# EAGLE design cardReader (EAGLE 8.4.0)
DELETE: MF
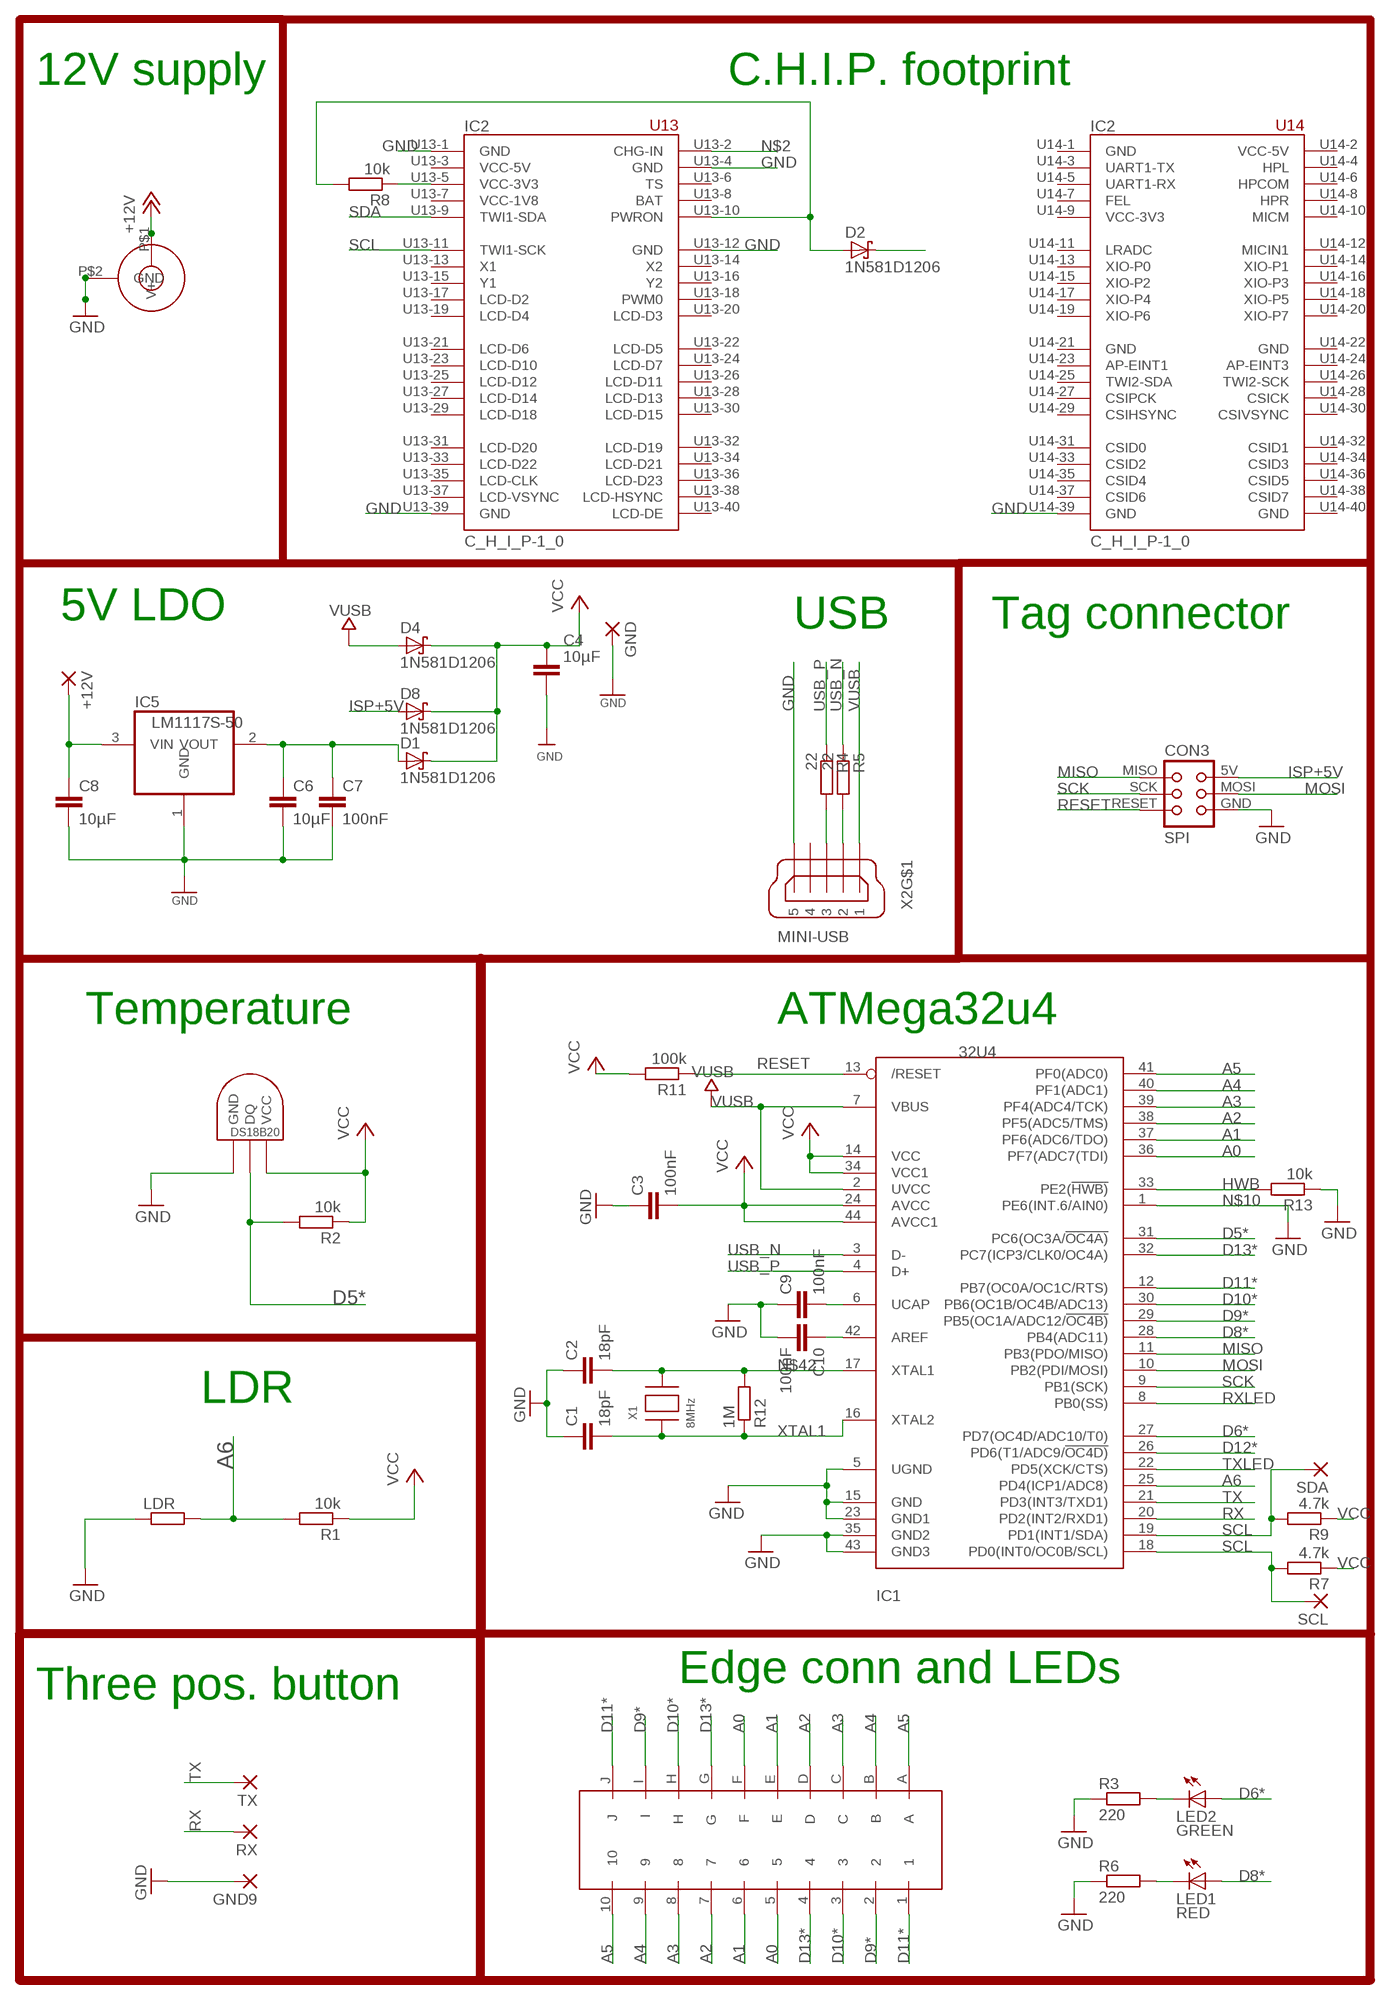
[diagram p0: schematic, sheet 1]

## Parts
+12V  SMD5  [SMD2,54-5,08]
C1  18pF  C-EUC0805K  [C0805K]
C2  18pF  C-EUC0805K  [C0805K]
C3  100nF  C-EUC0805K  [C0805K]
C4  10µF  CAPACITOR_NPOL-1206  [C1206]
C6  10µF  C-EUC0805K  [C0805K]
C7  100nF  C-EUC0805K  [C0805K]
C8  10µF  C-EUC0805K  [C0805K]
C9  100nF  C-EUC0805K  [C0805K]
C10  100nF  C-EUC0805K  [C0805K]
CON2  JACK_DC_BARREL  [DC_BARREL]
CON3  SPI  TINYISPT  [TC2030-MCP-NL]
D1  1N581D1206  [LED-1206]
D2  1N581D1206  [LED-1206]
D4  1N581D1206  [LED-1206]
D8  1N581D1206  [LED-1206]
GND  SMD5  [SMD2,54-5,08]
GND9  SMD5  [SMD2,54-5,08]
IC1  32U4  ATMEGA32U4-AU  [TQFP44]
IC2  C_H_I_P-1_0  [C_H_I_P-1_0]
IC5  LM1117S-50  REG1117  [SOT223]
LDR  R-EU_0207/2V  [0207/2V]
LED1  RED  LED5MM  [LED5MM]
LED2  GREEN  LED5MM  [LED5MM]
R1  10k  R-EU_R0805  [R0805]
R2  10k  R-EU_R0805  [R0805]
R3  220  R-EU_0204/7  [0204/7]
R4  22  R-EU_R0805  [R0805]
R5  22  R-EU_R0805  [R0805]
R6  220  R-EU_0204/7  [0204/7]
R7  4.7k  R-EU_R0805  [R0805]
R8  10k  R-EU_R0805  [R0805]
R9  4.7k  R-EU_R0805  [R0805]
R11  100k  R-EU_R0805  [R0805]
R12  1M  R-EU_R0805  [R0805]
R13  10k  R-EU_R0805  [R0805]
RX  SMD5  [SMD2,54-5,08]
SCL  SMD5  [SMD2,54-5,08]
SDA  SMD5  [SMD2,54-5,08]
TX  SMD5  [SMD2,54-5,08]
U$1  DS1820TO92  [DS1820]
U$3  CONN2X10PRINT  [CONN2X10PRINT]
X1  8MHz  XTALNX6035  [NX6035]
X2  MINI-USB  MINI-USB-SCHIELD-32005-201  [32005-201]

## Nets
+12V: +12V.1(P) C8.1 CON2.P$1(V+) IC5.3(VIN)
A0: IC1.36(PF7(ADC7(TDI)) U$3.5 U$3.F
A1: IC1.37(PF6(ADC6/TDO)) U$3.6 U$3.E
A2: IC1.38(PF5(ADC5/TMS)) U$3.7 U$3.D
A3: IC1.39(PF4(ADC4/TCK)) U$3.8 U$3.C
A4: IC1.40(PF1(ADC1)) U$3.9 U$3.B
A5: IC1.41(PF0(ADC0)) U$3.10 U$3.A
A6: IC1.25(PD4(ICP1/ADC8)) LDR.2 R1.2
AREF: C10.1 IC1.42(AREF)
D5*: IC1.31(PC6(OC3A/!OC4A)) R2.2 U$1.DQ
D6*: IC1.27(PD7(OC4D/ADC10/T0)) LED2.A
D8*: IC1.28(PB4(ADC11)) LED1.A
D9*: IC1.29(PB5(OC1A/ADC12/!OC4B)) U$3.2 U$3.I
D10*: IC1.30(PB6(OC1B/OC4B/ADC13)) U$3.3 U$3.H
D11*: IC1.12(PB7(OC0A/OC1C/RTS)) U$3.1 U$3.J
D12*: IC1.26(PD6(T1/ADC9/!OC4D))
D13*: IC1.32(PC7(ICP3/CLK0/OC4A)) U$3.4 U$3.G
GND [power]: C1.1 C2.1 C3.1 C4.2 C6.2 C7.2 C8.2 C9.1 C10.2 CON2.P$2(GND) CON3.GND GND9.1(P) GND.1(P) IC1.5(UGND) IC1.15(GND) IC1.23(GND1) IC1.35(GND2) IC1.43(GND3) IC2.U13-1(GND) IC2.U13-4(GND) IC2.U13-12(GND) IC2.U13-39(GND) IC2.U14-39(GND) IC5.1(GND) LDR.1 R3.1 R6.1 R13.1 U$1.GND X2.5
HWB: IC1.33(PE2(!HWB)) R13.2
ISP+5V: CON3.5V(VCC) D8.A
MISO: CON3.MISO IC1.11(PB3(PDO/MISO))
MOSI: CON3.MOSI IC1.10(PB2(PDI/MOSI))
N$1: C9.2 IC1.6(UCAP)
N$2: IC2.U13-2(CHG-IN)
N$3: LED2.K(C) R3.2
N$4: LED1.K(C) R6.2
N$9: C6.1 C7.1 D1.A IC5.2(VOUT)
N$10: D2.C IC1.1(PE6(INT.6/AIN0)) ; supply symbol labelled GND
N$42: C2.2 IC1.17(XTAL1) R12.2 X1.P$2
PWRON: D2.A IC2.U13-10(PWRON) R8.2
RESET: CON3.RESET IC1.13(/RESET) R11.1
RX: IC1.20(PD2(INT2/RXD1)) RX.1(P)
RXLED: IC1.8(PB0(SS))
SCK: CON3.SCK IC1.9(PB1(SCK))
SCL: IC1.18(PD0(INT0/OC0B/SCL)) IC2.U13-11(TWI1-SCK) R7.2 SCL.1(P)
SDA: IC1.19(PD1(INT1/SDA)) IC2.U13-9(TWI1-SDA) R9.2 SDA.1(P)
TX: IC1.21(PD3(INT3/TXD1)) TX.1(P)
TXLED: IC1.22(PD5(XCK/CTS))
USB_N: IC1.3(D-) R5.1
USB_P: IC1.4(D+) R4.1
USBC_N: R5.2 X2.2
USBC_P: R4.2 X2.3
VCC: C3.2 C4.1 D1.C D4.C D8.C IC1.14(VCC) IC1.24(AVCC) IC1.34(VCC1) IC1.44(AVCC1) R1.1 R2.1 R7.1 R9.1 R11.2 U$1.VDD(VCC)
VCC-3V3@1: IC2.U13-5(VCC-3V3) R8.1
VUSB: D4.A IC1.2(UVCC) IC1.7(VBUS) X2.1
XTAL1: C1.2 IC1.16(XTAL2) R12.1 X1.P$1
Unconnected: IC2.U13-3(VCC-5V) IC2.U13-6(TS) IC2.U13-7(VCC-1V8) IC2.U13-13(X1) IC2.U13-14(X2) IC2.U13-15(Y1) IC2.U13-16(Y2) IC2.U13-17(LCD-D2) IC2.U13-18(PWM0) IC2.U13-19(LCD-D4) IC2.U13-20(LCD-D3) IC2.U13-21(LCD-D6) IC2.U13-22(LCD-D5) IC2.U13-23(LCD-D10) IC2.U13-24(LCD-D7) IC2.U13-25(LCD-D12) IC2.U13-26(LCD-D11) IC2.U13-27(LCD-D14) IC2.U13-28(LCD-D13) IC2.U13-29(LCD-D18) IC2.U13-30(LCD-D15) IC2.U13-31(LCD-D20) IC2.U13-32(LCD-D19) IC2.U13-33(LCD-D22) IC2.U13-34(LCD-D21) IC2.U13-35(LCD-CLK) IC2.U13-36(LCD-D23) IC2.U13-37(LCD-VSYNC) IC2.U13-38(LCD-HSYNC) IC2.U13-40(LCD-DE) IC2.U14-2(VCC-5V) IC2.U14-3(UART1-TX) IC2.U14-4(HPL) IC2.U14-5(UART1-RX) IC2.U14-6(HPCOM) IC2.U14-7(FEL) IC2.U14-8(HPR) IC2.U14-9(VCC-3V3) IC2.U14-10(MICM) IC2.U14-11(LRADC) IC2.U14-12(MICIN1) IC2.U14-13(XIO-P0) IC2.U14-14(XIO-P1) IC2.U14-15(XIO-P2) IC2.U14-16(XIO-P3) IC2.U14-17(XIO-P4) IC2.U14-18(XIO-P5) IC2.U14-19(XIO-P6) IC2.U14-20(XIO-P7) IC2.U14-23(AP-EINT1) IC2.U14-24(AP-EINT3) IC2.U14-25(TWI2-SDA) IC2.U14-26(TWI2-SCK) IC2.U14-27(CSIPCK) IC2.U14-28(CSICK) IC2.U14-29(CSIHSYNC) IC2.U14-30(CSIVSYNC) IC2.U14-31(CSID0) IC2.U14-32(CSID1) IC2.U14-33(CSID2) IC2.U14-34(CSID3) IC2.U14-35(CSID4) IC2.U14-36(CSID5) IC2.U14-37(CSID6) IC2.U14-38(CSID7) X2.4 X2.M1(S:S1) X2.M2(S:S2) X2.M3(S:S3) X2.M4(S:S4)

## Notes on the sheet
- 12V supply | C.H.I.P. footprint
- 5V LDO | USB | Tag connector
- Temperature | ATMega32u4
- LDR
- Edge conn and LEDs
- Three pos. button

## Power pins joined to a net without a drawn wire
BAT: IC2.U13-8(BAT)
GND: IC2.U14-1(GND) IC2.U14-21(GND) IC2.U14-22(GND) IC2.U14-40(GND)

## Library data of the parts
+12V GND GND9 RX SCL SDA TX = wirepad:SMD5: SMD PAD
C1 C2 = rcl:C-EU: CAPACITOR, European symbol; ELECROW: C1797; LCSC: C1797; MPN: 77-VJ1206A180JXXPBC
C3 C7 C9 C10 = rcl:C-EU: CAPACITOR, European symbol; ELECROW: C49678; LCSC: C49678; MPN: 80-C1206C104K5R
C4 = dp_devices:CAPACITOR_NPOL: Non-Polarized capacitor in various packages
C6 C8 = rcl:C-EU: CAPACITOR, European symbol; ELECROW: C15850; LCSC: C15850; MPN: 77-VJ1206V106ZXQTBC
CON2 = lpatiny:JACK_DC_BARREL
CON3 = lpatiny:TINYISP: CONNECTOR
D1 D2 D4 D8 = lpatiny:1N581*: 1.0A SCHOTTKY BARRIER RECTIFIER Source: http://www.diodes.com/datasheets/ds23001.pdf
IC1 = adafruit:ATMEGA32U4: http://www.ladyada.net/library/eagle; LCSC: C44854; MPN: 556-ATMEGA32U4RC-AU
IC2 = SENG:C_H_I_P-1_0: C.H.I.P. 1.0 Linux computer module with on chip power management unit
IC5 = burr-brown:REG1117: 800mA and 1A Low Dropout (LDO) Positive Regulator 1.8V, 2.5V, 2.85V, 3.3V, 5V, and Adj; LCSC: C126027; MPN: REG1117; OC_FARNELL: 1097566; OC_NEWARK: 14P6981
LDR R3 R6 = rcl:R-EU_: RESISTOR, European symbol
LED1 LED2 = SparkFun:LED: LEDs Standard schematic elements and footprints for 5mm, 3mm, 1206, and 0603 sized LEDs. 5mm - Spark Fun Electronics SKU : COM-00529 (and others)
R1 R2 R7-R9 R11 = rcl:R-EU_: RESISTOR, European symbol; ELECROW: C17407; LCSC: C17407; MPN: RC1206FR-07100KL
R4 R5 = rcl:R-EU_: RESISTOR, European symbol; ELECROW: C17561; LCSC: C17561
R12 = rcl:R-EU_: RESISTOR, European symbol; ELECROW: C17514; LCSC: C17514
R13 = rcl:R-EU_: RESISTOR, European symbol; ELECROW: C17414; LCSC: C17414
U$1 = Ava:DS1820: DS18B20 Programmable Resolution 1-Wire Digital Thermometer Description The DS18B20 digital thermometer provides 9-bit to 12-bit Celsius temperature measurements and has an alarm function with nonvolatile user-programmable upper and lower trigger points. The DS18B20 communicates over a 1-Wire® bus that by definition requires only one data line (and ground) for communication with a central microprocessor. It has an operating temperature range of -55°C to +125°C and is accurate to ±0.5°C over the range of -10°C to +85°C. In addition, the DS18B20 can derive power directly from the data line ("parasite power"), eliminating the need for an external power supply. Each DS18B20 has a unique 64-bit serial code, which allows multiple DS18B20s to function on the same 1-Wire bus. Thus, it is simple to use one microprocessor to control many DS18B20s distributed over a large area. Applications that can benefit from this feature include HVAC environmental controls, temperature monitoring systems inside buildings, equipment, or machinery, and process monitoring and control systems.
U$3 = edgeConn2x10:CONN2X10PRINT: Footprint for 10/20 edge connector.
X1 = lpatiny:XTAL: Low cost SMT crystals, no capacitors included http://www.ladyada.net/library/eagle; LCSC: C122522; MPN: 729-F60800010
X2 = con-cypressindustries:MINI-USB-SCHIELD-: MINI USB-B Conector Source: www.cypressindustries.com; LCSC: C46391; MPN: 649-10033526-N3212LF

## Net classes
0 default: width 0.254 mm, clearance 0.25 mm
1 power: width 0.254 mm, drill 0.305 mm, clearance 0.25 mm
2 VIN: width 0.254 mm, clearance 0.25 mm
3 fine: width 0.254 mm, clearance 0.25 mm
4 aref: width 0.254 mm, clearance 0.25 mm

## Board
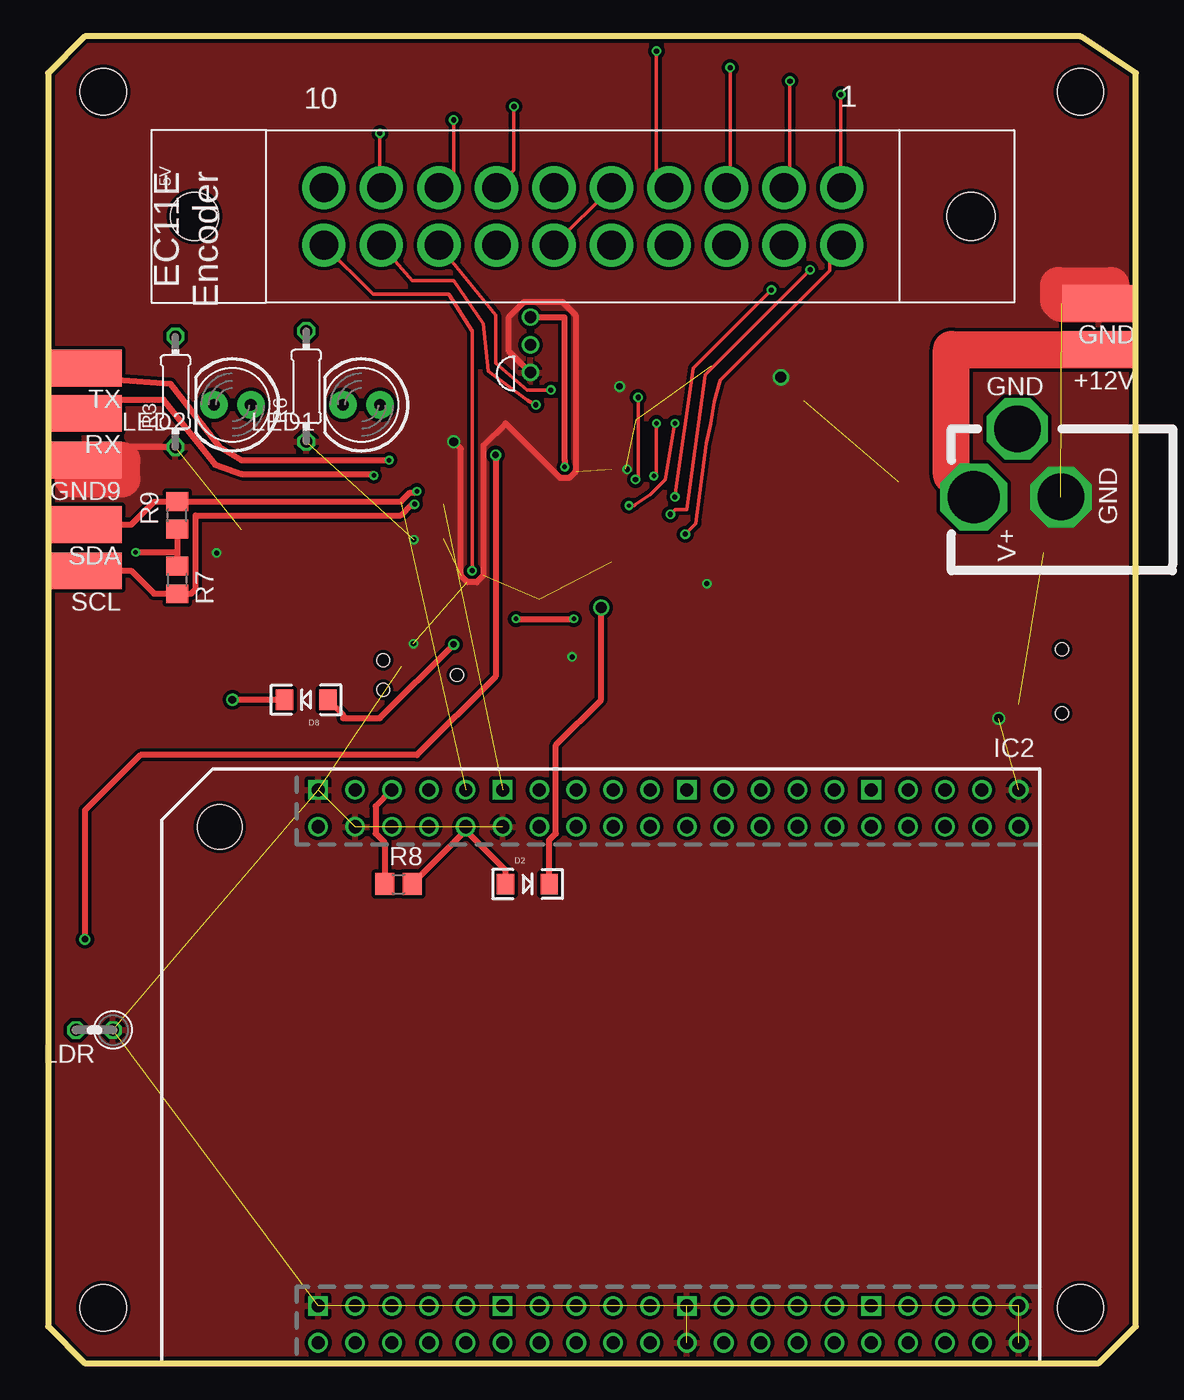
[diagram p1: board, top side]
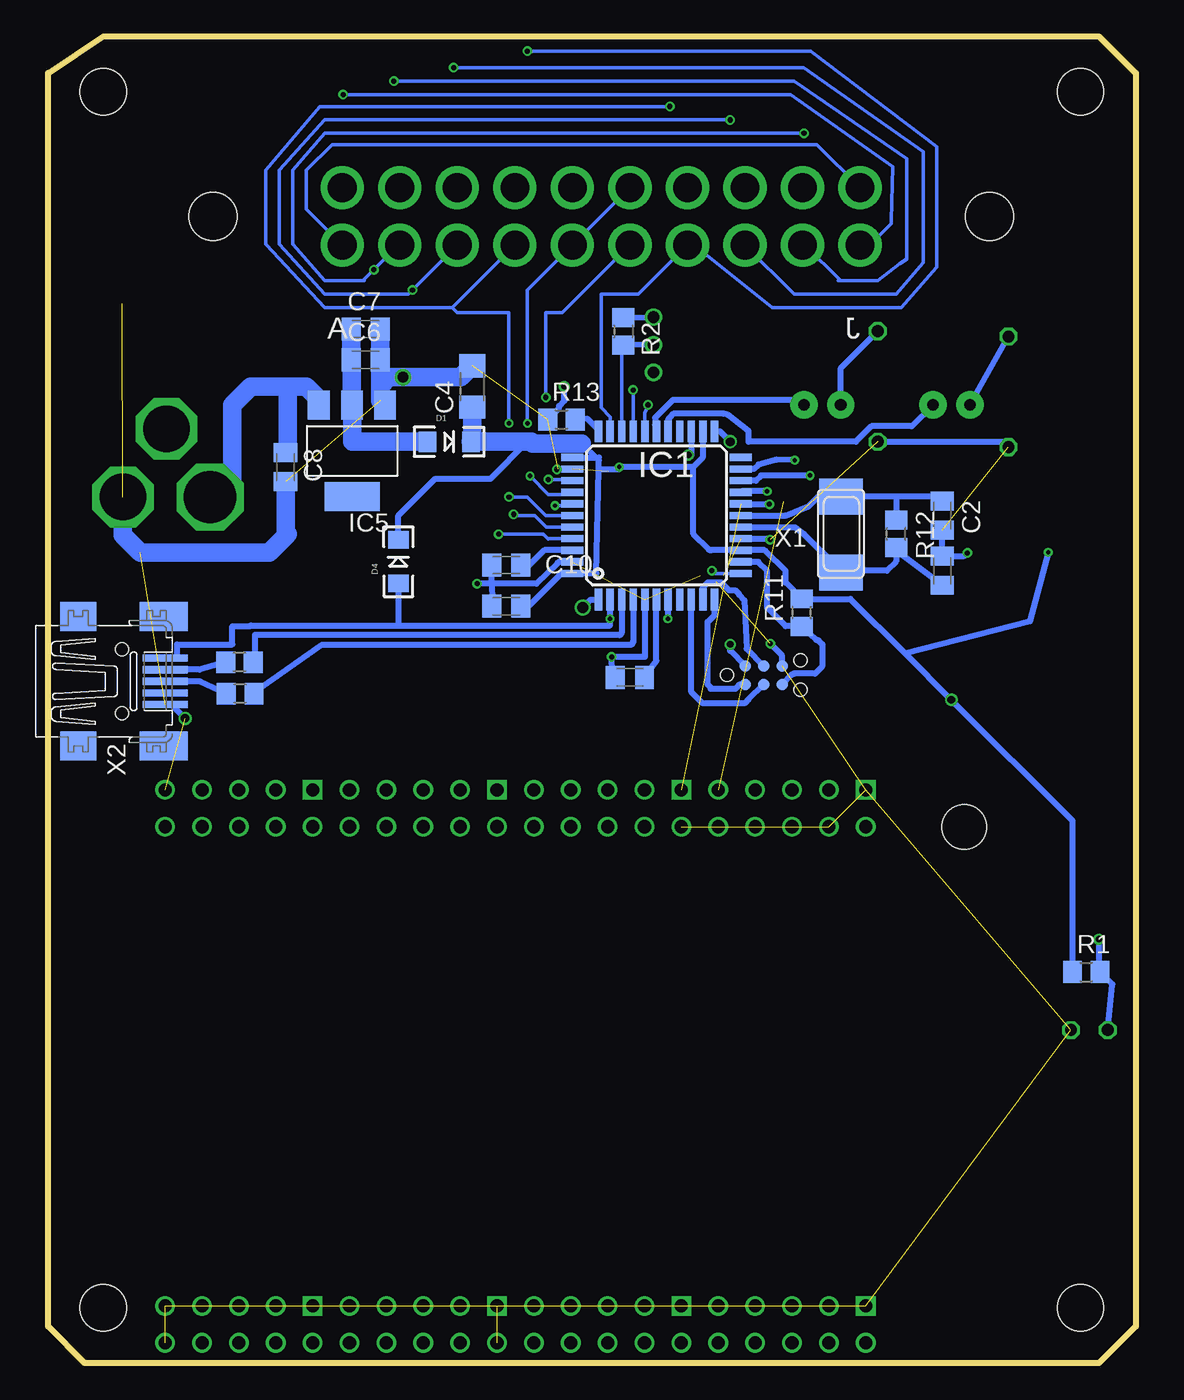
[diagram p2: board, bottom side, seen from below]

Size 74.93 x 91.44 mm. Coordinates in mm from the lower left corner, seen from the top.
Outline: 0,88.9 0,2.54 2.54,0 72.39,0 74.93,2.54 74.93,88.9 71.12,91.44 2.54,91.44 0,88.9
Copper layers (1*2*15*16): Top 0.035mm / dielectric 0.2mm / layer 2 0.0175mm / dielectric 1.1mm / layer 15 0.0175mm / dielectric 0.2mm / Bottom 0.035mm
Design rules "SeeedStudio_DRU_no_angle_20130527": minimum track width 6mil, minimum drill 12mil, track to track 6mil, track to pad 6mil, pad to pad 6mil, via to via 6mil, smd to smd 0mil, copper to edge 10mil, drill to drill 10mil, minimum pad ring 6mil, minimum via ring 6mil, stop-mask expansion 2mil, vias tented up to drill 25mil, thermal gap 10mil
Holes 3.2 mm at 3.81,87.63 3.81,3.81 71.12,87.63 71.12,3.81

### Footprints (pad centres in the part's own frame; a part is rotated, then mirrored left to right if it is on the bottom)
SMD2,54-5,08 = smd 2.54 x 5.08: 1 0,0
C0805K = smd 1.3 x 1.6: 1 -1,0; 2 1,0
C1206 = smd 1.6 x 1.803: 1 -1.422,0; 2 1.422,0
DC_BARREL = drill 3.6 pad 4.5 octagon: P$1 0,13.7 | drill 3.2 pad 4.064 octagon: P$2 0,7.7; P$3 4.7,10.7
TC2030-MCP-NL = smd 0.787 x 0.787: 5V 1.27,0.635; GND 3.81,0.635; MISO 1.27,-0.635; MOSI 2.54,0.635; RESET 3.81,-0.635; SCK 2.54,-0.635 | hole 0.889: 0,0; 5.08,-1.016; 5.08,1.016
LED-1206 = smd 1.2 x 1.4: A -1.5,0; C 1.5,0
TQFP44 = smd 1.5 x 0.5: 1 -5.8,4; 2 -5.8,3.2; 3 -5.8,2.4; 4 -5.8,1.6; 5 -5.8,0.8; 6 -5.8,0; 7 -5.8,-0.8; 8 -5.8,-1.6; 9 -5.8,-2.4; 10 -5.8,-3.2; 11 -5.8,-4; 23 5.8,-4; 24 5.8,-3.2; 25 5.8,-2.4; 26 5.8,-1.6; 27 5.8,-0.8; 28 5.8,0; 29 5.8,0.8; 30 5.8,1.6; 31 5.8,2.4; 32 5.8,3.2; 33 5.8,4 | smd 0.5 x 1.5: 12 -4,-5.8; 13 -3.2,-5.8; 14 -2.4,-5.8; 15 -1.6,-5.8; 16 -0.8,-5.8; 17 0,-5.8; 18 0.8,-5.8; 19 1.6,-5.8; 20 2.4,-5.8; 21 3.2,-5.8; 22 4,-5.8; 34 4,5.8; 35 3.2,5.8; 36 2.4,5.8; 37 1.6,5.8; 38 0.8,5.8; 39 0,5.8; 40 -0.8,5.8; 41 -1.6,5.8; 42 -2.4,5.8; 43 -3.2,5.8; 44 -4,5.8
C_H_I_P-1_0 = drill 0.9 square: U13-1 0,0; U13-11 -12.7,0; U13-21 -25.4,0; U13-31 -38.1,0; U14-1 0,35.56; U14-11 -12.7,35.56; U14-21 -25.4,35.56; U14-31 -38.1,35.56 | drill 0.9: U13-2 0,2.54; U13-3 -2.54,0; U13-4 -2.54,2.54; U13-5 -5.08,0; U13-6 -5.08,2.54; U13-7 -7.62,0; U13-8 -7.62,2.54; U13-9 -10.16,0; U13-10 -10.16,2.54; U13-12 -12.7,2.54; U13-13 -15.24,0; U13-14 -15.24,2.54; U13-15 -17.78,0; U13-16 -17.78,2.54; U13-17 -20.32,0; U13-18 -20.32,2.54; U13-19 -22.86,0; U13-20 -22.86,2.54; U13-22 -25.4,2.54; U13-23 -27.94,0; U13-24 -27.94,2.54; U13-25 -30.48,0; U13-26 -30.48,2.54; U13-27 -33.02,0; U13-28 -33.02,2.54; U13-29 -35.56,0; U13-30 -35.56,2.54; U13-32 -38.1,2.54; U13-33 -40.64,0; U13-34 -40.64,2.54; U13-35 -43.18,0; U13-36 -43.18,2.54; U13-37 -45.72,0; U13-38 -45.72,2.54; U13-39 -48.26,0; U13-40 -48.26,2.54; U14-2 0,38.1; U14-3 -2.54,35.56; U14-4 -2.54,38.1; U14-5 -5.08,35.56; U14-6 -5.08,38.1; U14-7 -7.62,35.56; U14-8 -7.62,38.1; U14-9 -10.16,35.56; U14-10 -10.16,38.1; U14-12 -12.7,38.1; U14-13 -15.24,35.56; U14-14 -15.24,38.1; U14-15 -17.78,35.56; U14-16 -17.78,38.1; U14-17 -20.32,35.56; U14-18 -20.32,38.1; U14-19 -22.86,35.56; U14-20 -22.86,38.1; U14-22 -25.4,38.1; U14-23 -27.94,35.56; U14-24 -27.94,38.1; U14-25 -30.48,35.56; U14-26 -30.48,38.1; U14-27 -33.02,35.56; U14-28 -33.02,38.1; U14-29 -35.56,35.56; U14-30 -35.56,38.1; U14-32 -38.1,38.1; U14-33 -40.64,35.56; U14-34 -40.64,38.1; U14-35 -43.18,35.56; U14-36 -43.18,38.1; U14-37 -45.72,35.56; U14-38 -45.72,38.1; U14-39 -48.26,35.56; U14-40 -48.26,38.1 | hole 3.08: 6.78,2.56
SOT223 = smd 1.499 x 2.007: 1 -2.261,-3.15; 2 0.025,-3.15; 3 2.311,-3.15 | smd 3.81 x 2.007: 4 0,3.15
0207/2V = drill 0.813 octagon: 1 -1.27,0; 2 1.27,0
LED5MM = drill 0.813 pad 1.88: A -1.27,0; K 1.27,0
R0805 = smd 1.3 x 1.5: 1 -0.95,0; 2 0.95,0
0204/7 = drill 0.813 octagon: 1 -3.81,0; 2 3.81,0
DS1820 = drill 0.8: DQ 2.54,-1.27; GND 0.635,-1.27; VDD 4.445,-1.27
CONN2X10PRINT = drill 1.981: 1 17.831,1.981; 2 13.868,1.981; 3 9.906,1.981; 4 5.944,1.981; 5 1.981,1.981; 6 -1.981,1.981; 7 -5.944,1.981; 8 -9.906,1.981; 9 -13.868,1.981; 10 -17.831,1.981; A 17.831,-1.981; B 13.868,-1.981; C 9.906,-1.981; D 5.944,-1.981; E 1.981,-1.981; F -1.981,-1.981; G -5.944,-1.981; H -9.906,-1.981; I -13.868,-1.981; J -17.831,-1.981 | hole 3.302: -26.746,0; 26.746,0
NX6035 = smd 2.5 x 3: P$1 2.665,0; P$2 -2.565,0
32005-201 = smd 3.1 x 0.5: 1 3,1.6; 2 3,0.8; 3 3,0; 4 3,-0.8; 5 3,-1.6 | smd 2.5 x 2: M1 -3,-4.45; M2 -3,4.45 | smd 3.3 x 2: M3 2.9,4.45; M4 2.9,-4.45 | hole 0.9: 0,2.2; 0,-2.2

### Placement (x,y rotation side)
+12V  72.39,69.85 90 top
C1  13.34,54.61 270 bottom
C2  13.34,58.42 90 bottom
C3  43.37,52.17 0 bottom
C4  45.72,67.31 90 bottom
C6  53.05,69.14 0 bottom
C7  53.05,71.26 0 bottom
C8  58.57,61.76 270 bottom
C9  34.85,47.26 0 bottom
C10  43.37,55 180 bottom
CON2  77.47,59.69 90 top
CON3  28.17,47.42 0 bottom
D1  47.31,63.5 0 bottom
D2  33.02,33.02 0 top
D4  50.8,55.24 90 bottom
D8  17.78,45.72 180 top
GND  72.39,73.02 90 top
GND9  2.54,62.23 90 top
IC1  33.02,58.42 90 bottom
IC2  18.61,39.51 180 top
IC5  53.98,62.87 180 bottom
LDR  3.2,22.96 180 top
LED1  21.59,66.04 180 top
LED2  12.7,66.04 180 top
R1  3.42,26.96 0 bottom
R2  35.31,71.11 270 bottom
R3  8.78,66.94 90 top
R4  61.7,46.14 180 bottom
R5  61.75,48.31 180 bottom
R6  17.78,67.31 90 top
R7  8.89,53.98 270 top
R8  24.13,33.02 0 top
R9  8.89,58.42 90 top
R11  23.01,51.73 90 bottom
R12  16.51,57.15 90 bottom
R13  39.57,65.02 0 bottom
RX  2.54,65.46 90 top
SCL  2.54,54.61 90 top
SDA  2.54,57.79 90 top
TX  2.54,68.58 90 top
U$1  31.95,67.64 90 top
U$3  36.83,79.03 0 top
X1  20.32,57.15 270 bottom
X2  69.85,46.99 0 bottom

### Tracks (layer width: path | path; a pad name or v marks a point on that pad's centre or on a via)
+12V
  Top 1.27: 71.12,69.85 +12V.1
  Top 2.54: CON2.P$1 62.23,61.23 62.23,69.85 71.12,69.85
  Bottom 1.27: IC5.3 56.29,66.34 arc-45 56.36,66.52 57.15,67.31 58.42,67.31 | 58.42,67.31 60.96,67.31 62.23,66.04 62.23,60.96 62.5,60.96 CON2.P$1 | C8.1 58.42,62.91 58.42,67.31
A0  (via drill 0.35)
  Top 0.254: U$3.F U$3.5 | v40.64,66.56 40.64,60.96 40.58,60.9 v40.46,60.9
  Bottom 0.254: U$3.F 39.51,72.39 40.64,72.39 v40.64,66.56 | v40.46,60.9 38.9,60.9 IC1.36
A1  (via drill 0.3)
  Top 0.254: v41.91,64.77 41.91,61.32 v41.73,61.14
  Bottom 0.254: U$3.6 U$3.E 41.91,73.95 v41.91,64.77 | 39.78,59.87 39.39,59.93 | 39.39,59.93 IC1.37 | v41.73,61.14 40.46,59.87 39.45,59.87 39.39,59.93
A2  (via drill 0.3, 0.35)
  Top 0.254: v32.09,86.6 32.09,82.22 U$3.7 | v43.18,64.77 42.53,60.91 41.49,59.87 40.46,59.18 40.38,59.1 v40.01,59.1
  Bottom 0.254: 47.09,72.73 55.88,72.73 59.93,77.13 59.93,82.21 56.22,86.6 v32.09,86.6 | U$3.D 47.09,72.73 | 47.09,72.73 46.75,72.39 43.18,72.39 v43.18,64.77 | v40.01,59.1 38.94,59.1 IC1.38
A3  (via drill 0.35)
  Top 0.254: v27.94,85.67 27.94,82.03 U$3.8 | v49.83,73.96 44.45,68.58 v43.18,59.69
  Bottom 0.254: v27.94,85.67 55.88,85.67 59,82.21 59,77.13 55.88,73.66 50.13,73.66 v49.83,73.96 U$3.C | v43.18,59.69 41.91,59.69 40.64,58.42 IC1.39
A4  (via drill 0.35)
  Top 0.254: v22.86,84.75 22.86,81.11 U$3.9 | v42.86,58.5 43.2,58.84 43.99,58.84 45.26,68.12 v52.49,75.35
  Bottom 0.254: 53.16,74.59 53.25,74.59 | 53.25,74.59 55.88,74.59 58.08,77.13 58.08,82.21 55.88,84.75 v22.86,84.75 | 53.25,74.59 v52.49,75.35 50.79,77.05 U$3.B | v42.86,58.5 42.79,58.42 41.41,58.42 40.62,57.62 IC1.40
  Bottom 0.406: 38.82,57.66 IC1.40
A5  (via drill 0.35)
  Top 0.254: U$3.A 53.84,76.22 53.84,75.3 46.29,67.75 45.9,66.27 45.65,64.75 45.34,63.36 44.62,57.88 44.62,57.85 v43.89,57.12
  Bottom 0.254: U$3.10 21.97,83.98 55.37,83.98 57.15,82.21 57.15,79.54 U$3.A | v43.89,57.12 40.83,57.12 40.82,57.12 40.8,57.12 40.46,56.78 40.42,56.82 IC1.41
A6  (via drill 0.45)
  Top 0.406: v30.82,62.59 30.82,47.33 25.4,41.91 6.35,41.91 2.54,38.1 v2.54,29.21
  Bottom 0.406: LDR.2 1.61,26.11 R1.2 2.54,27.04 v2.54,29.21 | IC1.25 30.62,62.55 30.71,62.46 30.71,62.48 v30.82,62.59
AREF
  Bottom 0.406: C10.1 42.19,54.82 arc-45 42.01,54.75 40.74,56.02 IC1.42
D5*
  Bottom 0.254: R2.2 35.42,70.04 IC1.31
  Bottom 0.406: 35.43,64.22 IC1.31 | U$1.DQ R2.2
D6*
  Bottom 0.406: LED2.A 15.45,64.56 18.22,64.56 19.28,63.5 26.67,63.5 26.67,64.25 28.12,65.35 28.39,65.42 31.86,65.42 32.12,65.16 32.12,65.12 32.23,65.01 32.22,65 IC1.27
D8*
  Bottom 0.406: LED1.A 23.2,66.38 31.89,66.38 33.12,65.16 33.12,64.67 33.02,64.57 IC1.28
D9*  (via drill 0.35)
  Top 0.254: v51.1,88.35 51.1,81.42 U$3.2 | U$3.I 25.08,74.59 27.94,74.59 29.98,71.62 30.32,68.37 32.99,66.38 v33.6,66.04
  Bottom 0.254: 20.5,74.59 20.33,74.59 | 20.33,74.59 17.78,74.59 16.27,75.76 15.79,76.1 15.79,82.99 23.55,88.35 v51.1,88.35 | 20.33,74.59 22.8,77.05 U$3.I | v33.6,66.04 33.82,65.48 IC1.29
D10*  (via drill 0.35)
  Top 0.254: v46.99,89.28 46.99,81.27 U$3.3 | U$3.H 30.82,72.22 30.82,68.92 33.02,67.07 v34.63,67.07
  Bottom 0.254: v46.99,89.28 22.86,89.28 14.66,83.48 14.66,75.86 16.51,73.66 23.53,73.66 U$3.H | v34.63,67.07 34.62,65.71 IC1.30
D11*  (via drill 0.35)
  Top 0.254: v54.61,87.43 54.61,81.06 U$3.1 | U$3.J 22.39,73.66 27.6,73.66 29.21,71.12 v29.21,54.61
  Bottom 0.254: v54.61,87.43 23.79,87.43 16.75,82.45 16.85,78.75 16.85,78.51 18.31,77.05 U$3.J | v29.21,54.61 29.02,54.42 IC1.12
D13*  (via drill 0.35)
  Top 0.254: v41.91,90.41 41.91,81.88 U$3.4
  Bottom 0.254: v41.91,90.41 22.38,90.41 13.73,83.82 13.73,75.51 16.17,72.73 25.06,72.73 30.4,77.05 U$3.G 34.28,73.66 36.83,73.66 36.83,65.84 36.2,65.2 36.2,64.22
  Bottom 0.406: 36.2,64.22 IC1.32
GND  (via drill 0.35, 0.45, 0.6, 0.75)  (22 unrouted)
  Top 0.406: R3.1 3.44,63.13 GND9.1 | U$1.GND 31.75,69.75 31.75,72.1 32.79,73.14 35.44,73.14 36.34,72.23 36.34,61.45 35.9,61 35.27,61 31.51,64.76 29.99,63.24 29.99,54.29 29.53,53.83 28.89,53.83 28.43,54.29 28.43,63.01 v27.94,63.5
  Top 2.54: GND9.1 1.73,61.42 1.73,60.96 5.08,60.96 5.08,62.23 | GND.1 69.83,73.02 69.61,73.24 69.61,74.27 73.2,74.27
  Bottom 0.254: IC1.35 38.86,61.58 39.78,61.58 39.8,61.6 v39.89,61.6
  Bottom 0.406: IC1.15 25.47,56.82 arc45 25.29,56.75 25.25,56.7 v25.2,56.76 | v11.61,55.84 11.77,55.68 arc45 11.95,55.61 C1.1 C2.1 | IC1.5 33.82,50.88 | 33.82,50.88 arc45 33.82,50.88 | IC1.43 39.66,55.22 arc-45 39.84,55.15 41.29,53.72 44.37,53.72 | 44.37,53.72 44.35,54.95 arc-45 C10.2 | 44.37,53.72 44.35,52.57 arc45 C3.1 | 44.37,53.72 v45.38,53.72 | CON3.GND 24.36,48.77 v25.17,49.58 | C9.1 36.07,47.6 v36.11,48.67 33.82,48.67 33.82,50.88 | X2.5 66.45,45.39 v65.49,44.44 | R6.1 9.14,63.5 R3.1 | IC1.23 28.66,64.22 v27.94,63.5 | R13.1 39.73,65.82 39.73,65.96 39.37,66.32 v39.37,67.31
  Bottom 1.27: CON2.P$2 69.77,57.07 68.58,55.88 59.69,55.88 58.42,57.15 58.57,57.3 C8.2 | C7.2 C6.2 52.05,67.31 | 52.05,67.31 52.05,66.35 IC5.1 | 52.05,67.31 51.41,67.94 v50.48,67.94 46.51,67.94 C4.2
  pour Top: 0,88.9 0,2.54 2.54,0 72.39,0 74.93,2.54 74.93,88.9 71.12,91.44 2.54,91.44
HWB
  Bottom 0.406: IC1.33 37.02,64.32 37.78,65.09 R13.2
ISP+5V  (via drill 0.45)
  Top 0.406: v27.94,49.53 22.86,44.45 20.32,44.45 20.32,44.68 D8.A
  Bottom 0.406: CON3.5V 27.94,49.1 v27.94,49.53
MISO
  Bottom 0.406: CON3.MISO 27.17,46.79 arc-45 27.35,46.71 27.57,46.49 29.21,46.49 | 29.29,46.49 29.21,46.49 | IC1.11 arc-45 IC1.11 29.02,51.56 29.49,51.09 29.49,46.77 29.21,46.49
MOSI
  Bottom 0.406: IC1.10 29.82,53.46 29.46,53.82 28.58,53.82 28.03,53.27 27.6,53.27 27.33,53.01 27.33,52.96 26.96,52.59 26.81,49.24 CON3.MOSI
N$1
  Bottom 0.406: C9.2 33.02,48.39 IC1.6
N$3
  Bottom 0.406: LED2.K R3.2
N$4
  Bottom 0.406: LED1.K 20.32,68.58 R6.2
N$9
  Bottom 1.27: D1.A 53.98,63.5 53.98,65.99 IC5.2 54,69.09 C6.1 C7.1
N$10  (via drill 0.75)
  Top 0.406: D2.C 34.52,36.05 34.97,36.5 34.97,42.59 38.1,45.72 v38.1,52.07
  Bottom 0.406: v38.1,52.07 37.55,52.62 IC1.1
N$42
  Bottom 0.406: IC1.17 24.13,58.42 22.54,59.05 21.91,59.69 20.32,59.69 X1.P$2 16.51,59.72 | 16.51,59.72 R12.2 | C2.2 13.58,59.72 16.51,59.72
PWRON
  Top 0.406: R8.2 28.77,36.7 | 28.77,36.7 IC2.U13-10 | D2.A 31.52,33.95 28.77,36.7
RESET
  Bottom 0.406: CON3.RESET 23.7,47.45 arc45 23.52,47.52 22.09,47.52 21.66,47.94 arc-45 21.59,48.12 21.59,49.53 21.84,49.78 arc-45 22.02,49.85 R11.1 23.04,50.8 24.13,50.8 25.4,52.07 25.4,54.61 26.01,55.22 IC1.13
RX  (via drill 0.3)
  Top 0.406: RX.1 2.21,66.42 7.95,66.42 11.5,61.91 13.34,61.28 22.34,61.28 v22.44,61.18
  Bottom 0.406: IC1.20 26.18,60.82 25.82,61.18 v22.44,61.18
SCK
  Bottom 0.406: CON3.SCK 26.68,45.73 26.84,45.58 26.95,45.47 29.83,45.47 30.62,46.25 IC1.9
SCL  (via drill 0.35)  (1 unrouted)
  Top 0.406: 25.25,59.11 25.18,59.04 arc45 v25.25,59.2 25.06,59.2 24.28,58.42 10.16,58.42 10.16,53.34 9.85,53.02 R7.2 7.3,53.02 5.71,54.61 SCL.1
  Bottom 0.406: IC1.18 25.47,59.22 arc45 25.29,59.15 25.25,59.11 v25.25,59.2
SDA  (via drill 0.3)  (1 unrouted)
  Top 0.406: SDA.1 5.71,57.79 7.3,59.37 R9.2 24.3,59.37 24.91,59.98 25.4,59.98 v25.4,60.08
  Bottom 0.406: v25.4,60.08 27.16,60.08 IC1.19
TX  (via drill 0.3)
  Top 0.406: TX.1 4.26,67.81 8.43,67.5 11.79,63.18 13.34,62.23 v23.5,62.23
  Bottom 0.406: v23.5,62.23 24.74,62.25 25.99,61.94 26.3,61.62 IC1.21
USB_N
  Bottom 0.254: R5.1 60.74,48.31 60.69,48.26
  Bottom 0.406: IC1.3 35.42,50.3 35.56,50.16 35.59,50.19 60.69,50.19 60.69,48.26 60.69,48.21
USB_P
  Bottom 0.406: IC1.4 34.62,49.76 arc90 34.87,49.51 56.07,49.51 60.39,46.46 R4.1
USBC_N
  Bottom 0.406: R5.2 64.49,47.79 X2.2
USBC_P
  Bottom 0.406: R4.2 64.45,46.99 X2.3 67.31,46.99
VCC  (via drill 0.3, 0.55)
  Top 0.406: U$1.VDD 35.56,72.08 35.56,62.23 35.59,62.23 v35.59,61.76 | R9.1 8.89,55.88 | 8.89,55.88 R7.1 | 8.89,55.88 v6.03,55.88 | D8.C v12.7,45.72
  Bottom 0.406: 36.99,61.6 37.17,54.42 IC1.44 39.45,54.42 arc-45 39.63,54.35 41.91,52.07 arc45 41.94,52.08 C3.2 | 36.99,61.6 36.99,62.23 | 36.99,62.23 36.99,62.42 IC1.34 | IC1.24 29.84,64.22 29.84,62.4 30.48,61.76 | 30.48,61.76 v35.59,61.76 35.59,61.6 36.99,61.6 | 30.48,61.76 30.48,57.15 29.42,56.09 arc-45 29.25,56.02 IC1.14 25.57,56.02 25.52,55.98 25.5,55.98 24.13,54.61 24.13,53.8 R11.2 19.66,52.68 15.88,48.9 | R2.1 U$1.VDD | R1.1 4.37,37.39 v12.7,45.72 15.88,48.9 | 36.99,62.23 38.15,63.39 38.16,63.39 | v6.03,55.88 7.3,51.12 15.88,48.9 | D4.C 50.8,58.42 48.26,60.96 44.45,60.96 41.91,63.5 41.65,63.5
  Bottom 1.27: 38.16,63.39 41.54,63.39 41.65,63.5 D1.C 45.72,63.59 C4.1
VCC-3V3@1
  Top 0.406: R8.1 23.18,35.88 22.56,36.5 22.56,38.38 IC2.U13-5
VUSB  (via drill 0.3)
  Top 0.406: v32.23,51.3 v36.22,51.3
  Bottom 0.406: X2.1 66.04,48.59 66.04,49.53 62.23,49.53 62.23,50.8 61.01,50.8 60.97,50.85 50.8,50.85 | 50.8,50.85 36.22,50.85 v36.22,51.3 IC1.2 | v32.23,51.3 v32.22,51.3 IC1.7 | D4.A 50.8,50.85
XTAL1
  Bottom 0.406: 20.32,54.61 17.14,54.61 16.51,55.24 R12.1 16.51,56.01 C1.2 | 20.32,54.61 X1.P$1 | 20.32,54.61 22.86,57.15 23.5,57.62 IC1.16

### Text on the board
tNames: EC11E / Encoder | 5V
tValues: Card Reader - v1.0.1
bValues: Card Reader - v1.0.1